# Altium schematic sheet LVDS.SchDoc
size 420 x 297 mm; SheetNumber: 21; SheetTotal: 32
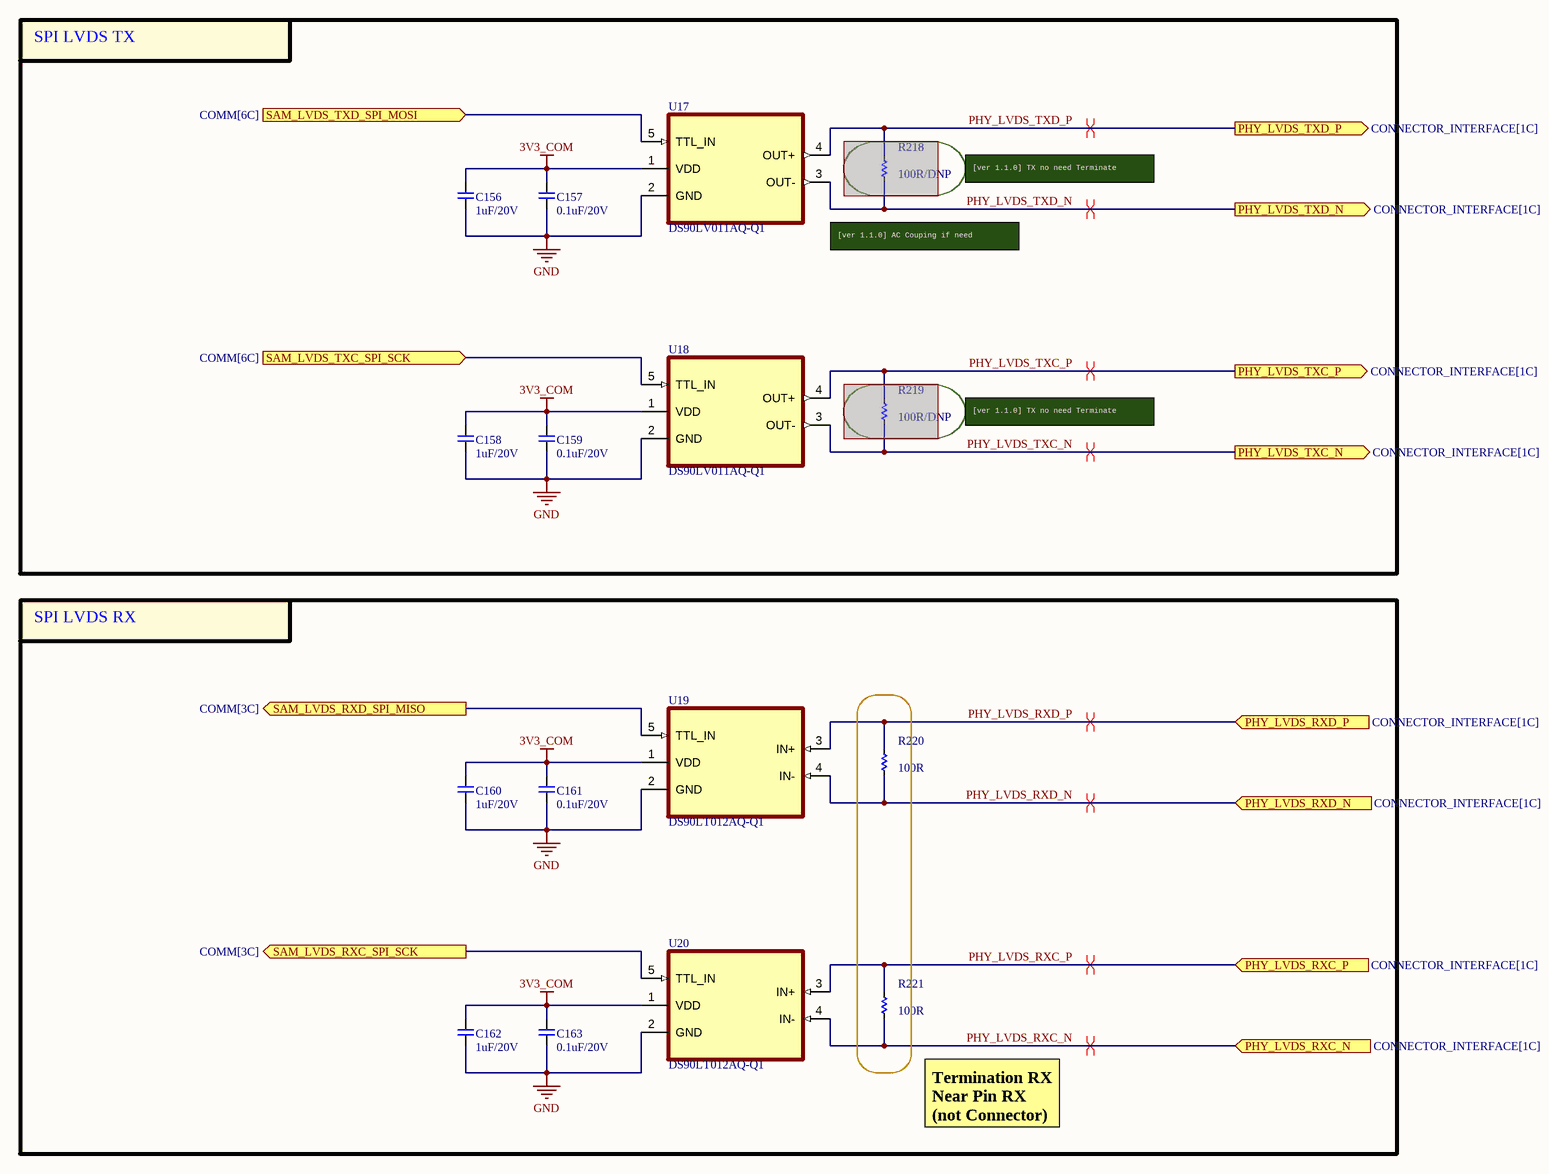
[diagram p0: LVDS.SchDoc]

## Parts
C156  1uF/20V  [CAP_C_1005X50_L]
C157  0.1uF/20V  [CAP_C_1005X50_L]
C158  1uF/20V  [CAP_C_1005X50_L]
C159  0.1uF/20V  [CAP_C_1005X50_L]
C160  1uF/20V  [CAP_C_1005X50_L]
C161  0.1uF/20V  [CAP_C_1005X50_L]
C162  1uF/20V  [CAP_C_1005X50_L]
C163  0.1uF/20V  [CAP_C_1005X50_L]
R218  100R/DNP  [RES_C_1005x30_L]  (masked out: inside a compile mask, not in the netlist)
R219  100R/DNP  [RES_C_1005x30_L]  (masked out: inside a compile mask, not in the netlist)
R220  100R  [RES_C_1005x30_L]
R221  100R  [RES_C_1005x30_L]
U17  DS90LV011AQ-Q1  [DS90LV011AQ-Q1]
U18  DS90LV011AQ-Q1  [DS90LV011AQ-Q1]
U19  DS90LT012AQ-Q1  [DS90LV011AQ-Q1]
U20  DS90LT012AQ-Q1  [DS90LV011AQ-Q1]

## Blocks framed on the sheet
SPI LVDS TX: C156-C159 R218 R219 U17 U18
SPI LVDS RX: C160-C163 R220 R221 U19 U20

## Ports
PHY_LVDS_RXC_N (in, see CONNECTOR_INTERFACE[1C]), PHY_LVDS_RXC_P (in, see CONNECTOR_INTERFACE[1C]), PHY_LVDS_RXD_N (in, see CONNECTOR_INTERFACE[1C]), PHY_LVDS_RXD_P (in, see CONNECTOR_INTERFACE[1C]), PHY_LVDS_TXC_N (out, see CONNECTOR_INTERFACE[1C]), PHY_LVDS_TXC_P (out, see CONNECTOR_INTERFACE[1C]), PHY_LVDS_TXD_N (out, see CONNECTOR_INTERFACE[1C]), PHY_LVDS_TXD_P (out, see CONNECTOR_INTERFACE[1C]), SAM_LVDS_RXC_SPI_SCK (out, see COMM[3C]), SAM_LVDS_RXD_SPI_MISO (out, see COMM[3C]), SAM_LVDS_TXC_SPI_SCK (in, see COMM[6C]), SAM_LVDS_TXD_SPI_MOSI (in, see COMM[6C])

## Nets
3V3_COM: C156.2 C157.2 C158.2 C159.2 C160.2 C161.2 C162.2 C163.2 U17.1(VDD) U18.1(VDD) U19.1(VDD) U20.1(VDD)
GND: C156.1 C157.1 C158.1 C159.1 C160.1 C161.1 C162.1 C163.1 U17.2(GND) U18.2(GND) U19.2(GND) U20.2(GND)
PHY_LVDS_RXC_N: R221.2 U20.4(IN-) ; port PHY_LVDS_RXC_N
PHY_LVDS_RXC_P: R221.1 U20.3(IN+) ; port PHY_LVDS_RXC_P
PHY_LVDS_RXD_N: R220.2 U19.4(IN-) ; port PHY_LVDS_RXD_N
PHY_LVDS_RXD_P: R220.1 U19.3(IN+) ; port PHY_LVDS_RXD_P
PHY_LVDS_TXC_N: U18.3(OUT-) ; port PHY_LVDS_TXC_N
PHY_LVDS_TXC_P: U18.4(OUT+) ; port PHY_LVDS_TXC_P
PHY_LVDS_TXD_N: U17.3(OUT-) ; port PHY_LVDS_TXD_N
PHY_LVDS_TXD_P: U17.4(OUT+) ; port PHY_LVDS_TXD_P
SAM_LVDS_RXC_SPI_SCK: U20.5(TTL_IN) ; port SAM_LVDS_RXC_SPI_SCK
SAM_LVDS_RXD_SPI_MISO: U19.5(TTL_IN) ; port SAM_LVDS_RXD_SPI_MISO
SAM_LVDS_TXC_SPI_SCK: U18.5(TTL_IN) ; port SAM_LVDS_TXC_SPI_SCK
SAM_LVDS_TXD_SPI_MOSI: U17.5(TTL_IN) ; port SAM_LVDS_TXD_SPI_MOSI

## Layout directives
differential pair: PHY_LVDS_RXC_N, PHY_LVDS_RXC_P, PHY_LVDS_RXD_N, PHY_LVDS_RXD_P, PHY_LVDS_TXC_N, PHY_LVDS_TXC_P, PHY_LVDS_TXD_N, PHY_LVDS_TXD_P

## Notes on the sheet
- [ver 1.1.0] TX no need Terminate
- [ver 1.1.0] AC Couping if need
- Termination RX
  Near Pin RX (not Connector)
- Project:
- Sub-system:
- Design by:
- Sheet title:
- Sheet
- A3
- of
- Checked by:
- Approved by:
- Revision:
- Document No:
- Size:
- Date:

## Library data of the parts
C156-C163 = _CAP_C_2: CAP CHIP
R218-R221 = _RES_B_2: RES
U17 U18 = DS90LV011AQ-Q1: Automotive LVDS Differential Driver
U19 U20 = DS90LT012AQ-Q1: Automotive LVDS Differential Line Receiver